# Altium schematic sheet ESP32S3-9INCHES_DISPLAY.SchDoc
size A3; SheetNumber: 1; SheetTotal: 1
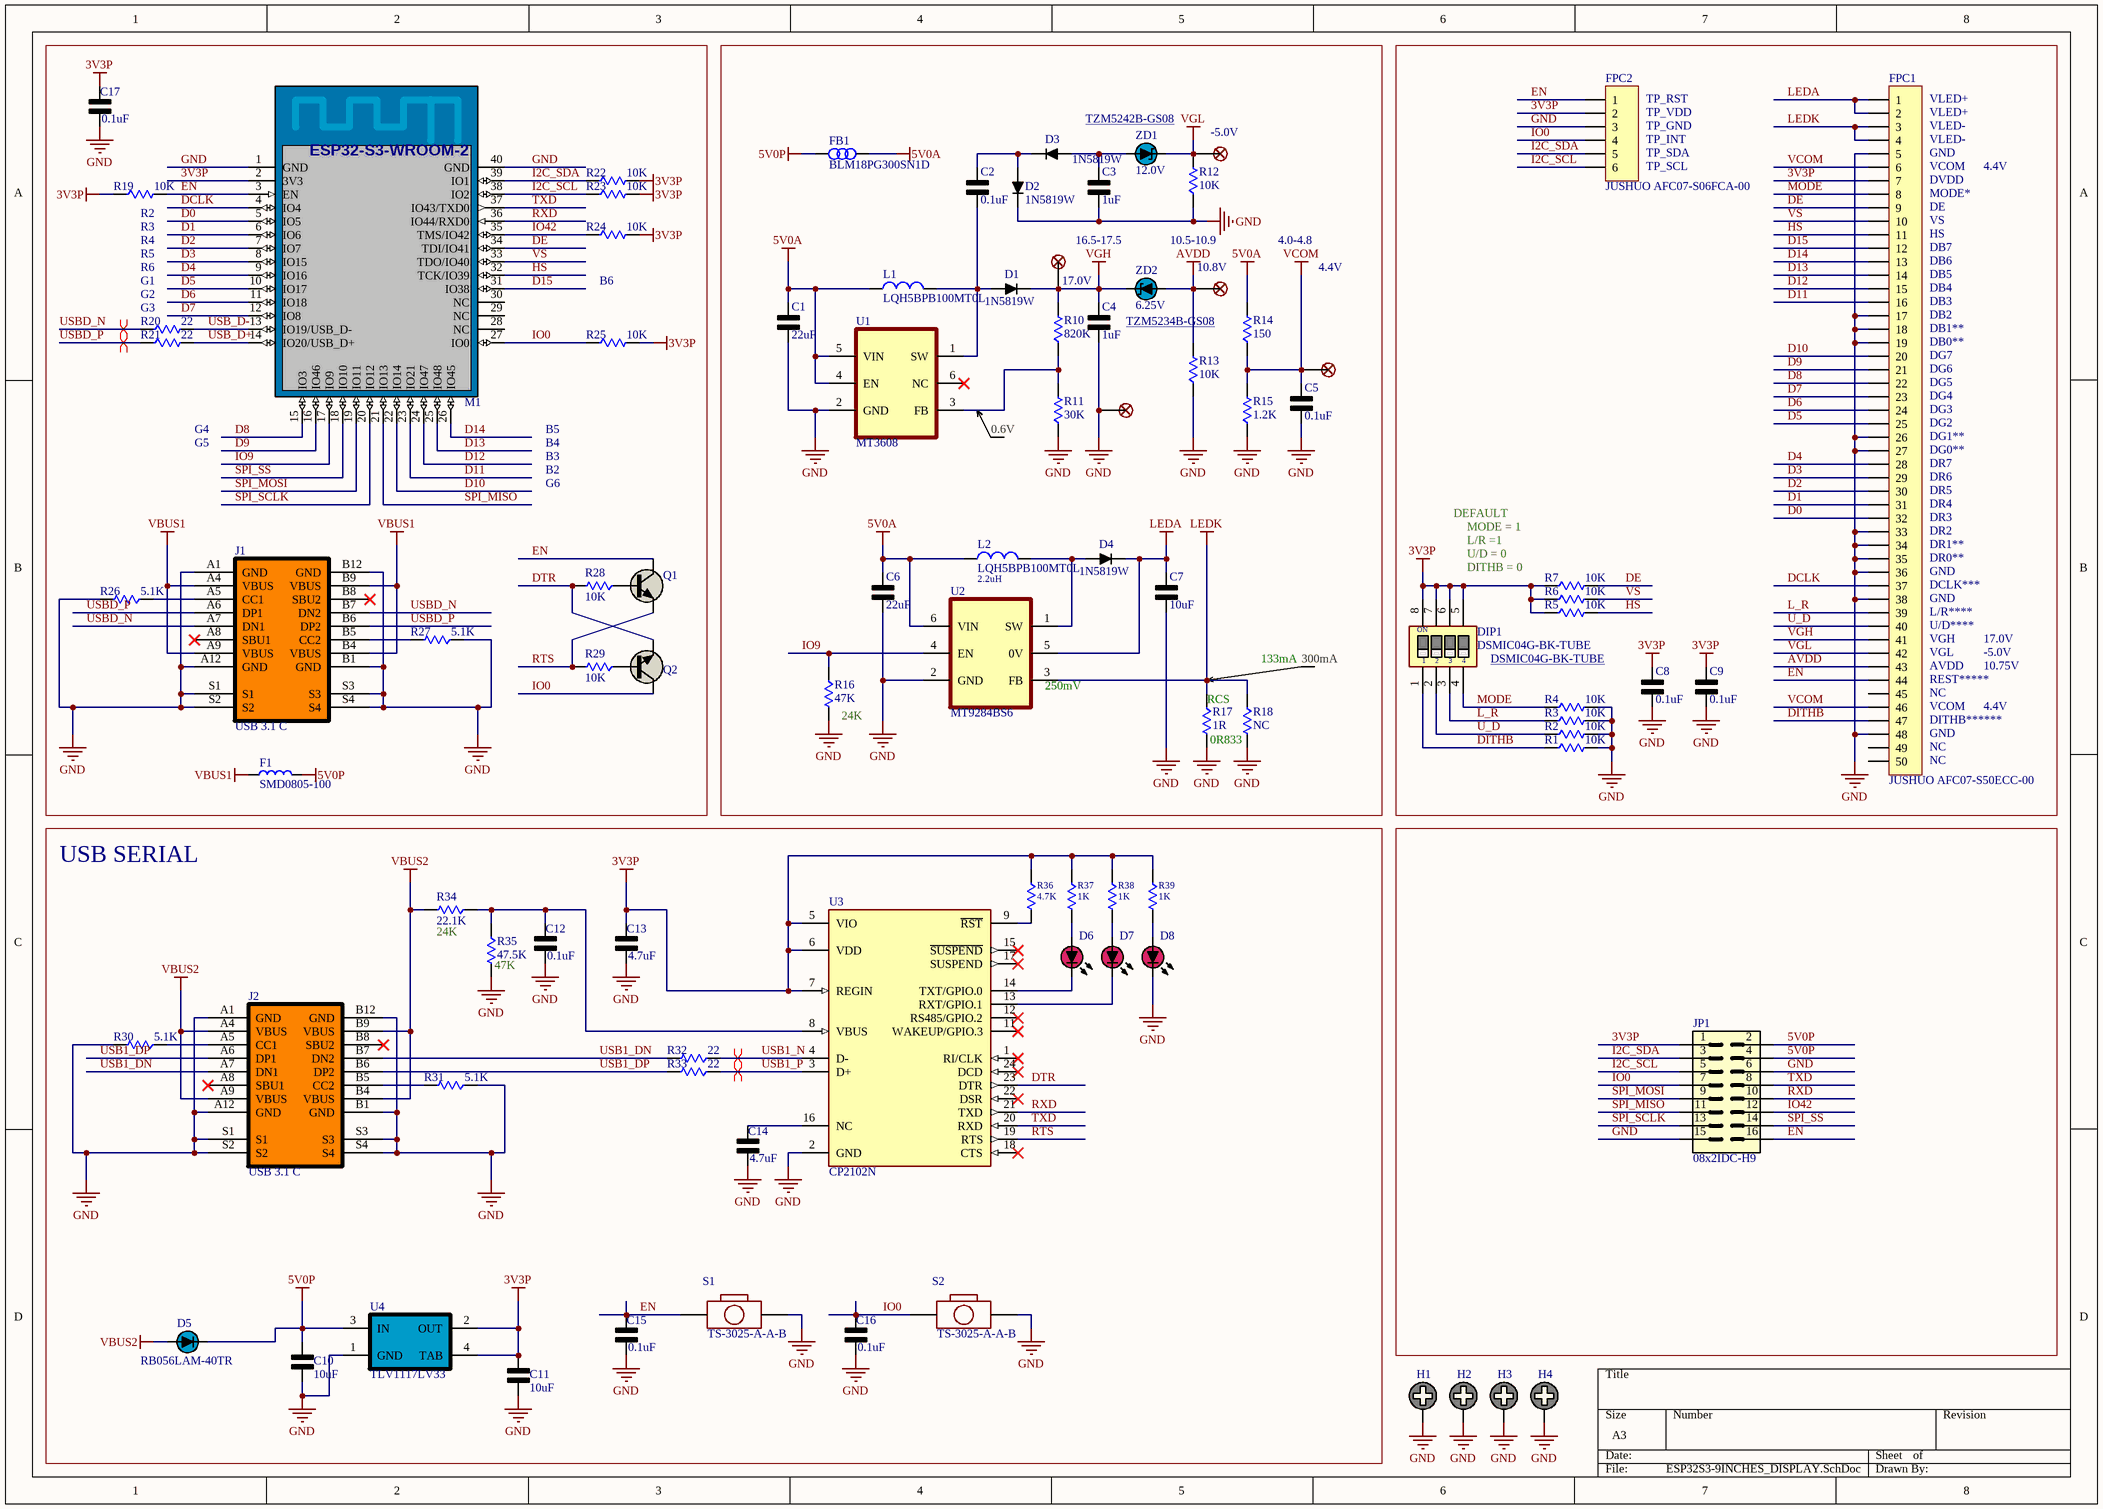
[diagram p0: ESP32S3-9INCHES_DISPLAY.SchDoc]

## Parts
AVDD  Test Point  [MICRO-FIDUCIAL]  (value not drawn)
C1  22uF  [2012[0805]]
C2  0.1uF  [1608[0603]]
C3  1uF  [1608[0603]]
C4  1uF  [1608[0603]]
C5  0.1uF  [1608[0603]]
C6  22uF  [2012[0805]]
C7  10uF  [2012[0805]]
C8  0.1uF  [1608[0603]]
C9  0.1uF  [1608[0603]]
C10  10uF  [2012[0805]]
C11  10uF  [2012[0805]]
C12  0.1uF  [1608[0603]]
C13  4.7uF  [1608[0603]]
C14  4.7uF  [1608[0603]]
C15  0.1uF  [1608[0603]]
C16  0.1uF  [1608[0603]]
C17  0.1uF  [1608[0603]]
D1  1N5819W  [SOD123FL]
D2  1N5819W  [SOD123FL]
D3  1N5819W  [SOD123FL]
D4  1N5819W  [SOD123FL]
D5  RB056LAM-40TR  [SOD128]
D6  LED  [LED_0603_RED]  (value not drawn)
D7  LED  [LED_0603_YELLOW]  (value not drawn)
D8  LED  [LED_0603_YELLOW]  (value not drawn)
DIP1  DSMIC04G-BK-TUBE  [DSMIC04G-BK]
F1  SMD0805-100  [2012[0805]]
FB1  BLM18PG300SN1D  [1608[0603]]
FPC1  JUSHUO AFC07-S50ECC-00  [68715014022]
FPC2  JUSHUO AFC07-S06FCA-00  [68710614522]
GND  Test Point  [MICRO-FIDUCIAL]  (value not drawn)
H1  NUT  [Nut-M3-5 SMT]  (value not drawn)
H2  NUT  [Nut-M3-5 SMT]  (value not drawn)
H3  NUT  [Nut-M3-5 SMT]  (value not drawn)
H4  NUT  [Nut-M3-5 SMT]  (value not drawn)
J1  USB 3.1 C  [USB-C-16P]
J2  USB 3.1 C  [USB-C-16P]
JP1  08x2IDC-H9  [2X08]
L1  LQH5BPB100MT0L  [INDUCTOR_5X5MM_NR5040_NOTHERMALS]
L2  LQH5BPB100MT0L  [INDUCTOR_5X5MM_NR5040_NOTHERMALS]
M1  ESP32-S3-WROOM-2  [ESP32-S3-WROOM-1]  (value not drawn)
Q1  MMBT2222ALT1G  [SOT23N-NPN]  (value not drawn)
Q2  MMBT2222ALT1G  [SOT23N-NPN]  (value not drawn)
R1  10K  [1608[0603]]
R2  10K  [1608[0603]]
R3  10K  [1608[0603]]
R4  10K  [1608[0603]]
R5  10K  [1608[0603]]
R6  10K  [1608[0603]]
R7  10K  [1608[0603]]
R10  820K  [1608[0603]]
R11  30K  [1608[0603]]
R12  10K  [1608[0603]]
R13  10K  [1608[0603]]
R14  150  [1608[0603]]
R15  1.2K  [1608[0603]]
R16  47K  [1608[0603]]
R17  1R  [2012[0805]]
R18  NC  [2012[0805]]
R19  10K  [1608[0603]]
R20  22  [1608[0603]]
R21  22  [1608[0603]]
R22  10K  [1608[0603]]
R23  10K  [1608[0603]]
R24  10K  [1608[0603]]
R25  10K  [1608[0603]]
R26  5.1K  [1608[0603]]
R27  5.1K  [1608[0603]]
R28  10K  [1608[0603]]
R29  10K  [1608[0603]]
R30  5.1K  [1608[0603]]
R31  5.1K  [1608[0603]]
R32  22  [1608[0603]]
R33  22  [1608[0603]]
R34  22.1K  [1608[0603]]
R35  47.5K  [1608[0603]]
R36  4.7K  [1608[0603]]
R37  1K  [1608[0603]]
R38  1K  [1608[0603]]
R39  1K  [1608[0603]]
S1  TS-3025-A-A-B  [SW2-SMD-3.0X2.5X1.2+0.4MM]
S2  TS-3025-A-A-B  [SW2-SMD-3.0X2.5X1.2+0.4MM]
U1  MT3608  [SOT23-6]
U2  MT9284BS6  [SOT23-6]
U3  CP2102N  [QFN24_4X4]
U4  TLV1117LV33  [MP04A_N]
VCOM  Test Point  [MICRO-FIDUCIAL]  (value not drawn)
VGH  Test Point  [MICRO-FIDUCIAL]  (value not drawn)
VGL  Test Point  [MICRO-FIDUCIAL]  (value not drawn)
ZD1  12.0V  [SOD80]
ZD2  6.25V  [SOD80]

## Blocks framed on the sheet
USB SERIAL: C10-C16 D5-D8 J2 R30-R39 S1 S2 U3 U4

## Nets
3V3P: C8.2 C9.2 C11.2 C13.2 C17.2 DIP1.5 DIP1.6 DIP1.7 DIP1.8 FPC1.7 FPC2.2 JP1.1 M1.2(3V3) R5.2 R6.2 R7.2 R19.2 R22.1 R23.1 R24.1 R25.1 R36.2 R37.2 R38.2 R39.2 U3.5(VIO) U3.6(VDD) U3.7(REGIN) U4.2(OUT) U4.4(TAB)
5V0A: C1.2 C6.2 FB1.1 L1.1 L2.1 R14.1 U1.4(EN) U1.5(VIN) U2.6(VIN)
5V0P: C10.2 D5.2(K) F1.1 FB1.2 JP1.2 JP1.4 U4.3(IN)
AVDD: AVDD.1 FPC1.43 R13.1 ZD2.1(A)
GND: C1.1 C3.1 C4.1 C5.1 C6.1 C7.1 C8.1 C9.1 C10.1 C11.1 C12.1 C13.1 C14.1 C15.1 C16.1 C17.1 D2.2(K) D8.2(K) FPC1.5 FPC1.17 FPC1.18 FPC1.19 FPC1.26 FPC1.27 FPC1.33 FPC1.34 FPC1.35 FPC1.36 FPC1.38 FPC1.48 FPC1.Z1 FPC1.Z2 FPC2.3 FPC2.Z1 FPC2.Z2 GND.1 H1.0(GND) H2.0(GND) H3.0(GND) H4.0(GND) J1.A1(GND) J1.A12(GND) J1.B1(GND) J1.B12(GND) J1.S1 J1.S2 J1.S3 J1.S4 J2.A1(GND) J2.A12(GND) J2.B1(GND) J2.B12(GND) J2.S1 J2.S2 J2.S3 J2.S4 JP1.6 JP1.15 M1.1(GND) M1.40(GND) M1.41(EPAD) R1.1 R2.1 R3.1 R4.1 R11.2 R12.2 R13.2 R15.2 R16.1 R17.1 R18.1 R26.1 R27.2 R30.1 R31.2 R35.1 S1.2 S2.2 U1.2(GND) U2.2(GND) U3.2(GND) U3.25(HEAT_TAB) U4.1(GND)
LEDA: C7.2 D4.2(K) FPC1.1 FPC1.2 U2.5(0V)
LEDK: FPC1.3 FPC1.4 R17.2 R18.2 U2.3(FB)
VBUS1: F1.2 J1.A4(VBUS) J1.A9(VBUS) J1.B4(VBUS) J1.B9(VBUS)
VBUS2: D5.1(A) J2.A4(VBUS) J2.A9(VBUS) J2.B4(VBUS) J2.B9(VBUS) R34.1
VCOM: C5.2 FPC1.6 FPC1.46 R14.2 R15.1 VCOM.1
VGH: C4.2 D1.2(K) FPC1.41 R10.1 VGH.1 ZD2.2(K)
VGL: FPC1.42 R12.1 VGL.1 ZD1.2(K)
D0: FPC1.32 M1.5(IO5)
D1: FPC1.31 M1.6(IO6)
D2: FPC1.30 M1.7(IO7)
D3: FPC1.29 M1.8(IO15)
D4: FPC1.28 M1.9(IO16)
D5: FPC1.25 M1.10(IO17)
D6: FPC1.24 M1.11(IO18)
D7: FPC1.23 M1.12(IO8)
D8: FPC1.22 M1.15(IO3)
D9: FPC1.21 M1.16(IO46)
D10: FPC1.20 M1.22(IO14)
D11: FPC1.16 M1.23(IO21)
D12: FPC1.15 M1.24(IO47)
D13: FPC1.14 M1.25(IO48)
D14: FPC1.13 M1.26(IO45)
D15: FPC1.12 M1.31(IO38)
DCLK: FPC1.37 M1.4(IO4)
DE: FPC1.9 M1.34(TDI/IO41) R7.1
DITHB: DIP1.1 FPC1.47 R1.2
DTR: Q2.2(E) R28.1 U3.23(DTR)
EN: C15.2 FPC1.44 FPC2.1 JP1.16 M1.3(EN) Q1.3(C) R19.1 S1.1
HS: FPC1.11 M1.32(TCK/IO39) R5.1
I2C_SCL: FPC2.6 JP1.5 M1.38(IO2) R23.2
I2C_SDA: FPC2.5 JP1.3 M1.39(IO1) R22.2
IO0: C16.2 FPC2.4 JP1.7 M1.27(IO0) Q2.3(C) R25.2 S2.1
IO9: M1.17(IO9) R16.2 U2.4(EN)
IO42: JP1.12 M1.35(TMS/IO42) R24.2
L_R: DIP1.3 FPC1.39 R3.2
MODE: DIP1.4 FPC1.8 R4.2
RTS: Q1.2(E) R29.1 U3.19(RTS)
RXD: JP1.10 M1.36(IO44/RXD0) U3.21(TXD)
SPI_MISO: JP1.11 M1.21(IO13)
SPI_MOSI: JP1.9 M1.19(IO11)
SPI_SCLK: JP1.13 M1.20(IO12)
SPI_SS: JP1.14 M1.18(IO10)
TXD: JP1.8 M1.37(IO43/TXD0) U3.20(RXD)
U_D: DIP1.2 FPC1.40 R2.2
USB1_DN: J2.A7(DN1) J2.B7(DN2) R32.1
USB1_DP: J2.A6(DP1) J2.B6(DP2) R33.1
USB1_N: R32.2 U3.4(D-)
USB1_P: R33.2 U3.3(D+)
USB_D+: M1.14(IO20/USB_D+) R21.1
USB_D-: M1.13(IO19/USB_D-) R20.1
USBD_N: J1.A7(DN1) J1.B7(DN2) R20.2
USBD_P: J1.A6(DP1) J1.B6(DP2) R21.2
VS: FPC1.10 M1.33(TDO/IO40) R6.1
NetC2_1: C2.1 D1.1(A) L1.2 U1.1(SW)
NetC2_2: C2.2 D2.1(A) D3.2(K)
NetC3_2: C3.2 D3.1(A) ZD1.1(A)
NetC12_2: C12.2 R34.2 R35.2 U3.8(VBUS)
NetC14_2: C14.2 U3.16(NC)
NetD4_1: D4.1(A) L2.2 U2.1(SW)
NetD6_1: D6.1(A) R37.1
NetD6_2: D6.2(K) U3.14(TXT/GPIO.0)
NetD7_1: D7.1(A) R38.1
NetD7_2: D7.2(K) U3.13(RXT/GPIO.1)
NetD8_1: D8.1(A) R39.1
NetJ1_A5: J1.A5(CC1) R26.2
NetJ1_B5: J1.B5(CC2) R27.1
NetJ2_A5: J2.A5(CC1) R30.2
NetJ2_B5: J2.B5(CC2) R31.1
NetQ1_1: Q1.1(B) R28.2
NetQ2_1: Q2.1(B) R29.2
NetR10_2: R10.2 R11.1 U1.3(FB)
NetR36_1: R36.1 U3.9(~{RST})

Not connected (* = marked no-connect by the designer): FPC1 45 49 50; J1 A8(SBU1)* B8(SBU2)*; J2 A8(SBU1)* B8(SBU2)*; M1 28(NC) 29(NC) 30(NC); U1 6(NC)*; U3 1(RI/CLK)* 10(NC) 11(WAKEUP/GPIO.3)* 12(RS485/GPIO.2)* 15(~{SUSPEND})* 17(SUSPEND)* 18(CTS)* 22(DSR)* 24(DCD)*

## Layout directives
differential pair: USB1_N, USB1_P, USBD_N, USBD_P

## Notes on the sheet
- (near FPC2) TP_RST
- (near FPC1) VLED+
- TZM5242B-GS08 <https://www.es.co.th/detail.asp?Prod=013503850>
- (near VGL) -5.0V
- (near FPC2) TP_VDD
- (near FPC2) TP_GND
- (near FPC2) TP_INT
- (near FPC2) TP_SDA
- (near FPC2) TP_SCL
- (near FPC1) VLED-
- (near FPC1) GND
- (near FPC1) VCOM
- (near FPC1) DVDD
- 4.4V
- (near R19) R2
- (near R19) R3
- (near R19) R4
- (near VGH) 16.5-17.5
- 10.5-10.9
- 4.0-4.8
- (near FPC1) MODE*
- (near FPC1) DE
- (near FPC1) VS
- (near FPC1) HS
- R5
- R6
- G1
- G2
- (near R20) G3
- B6
- (near VGH) 17.0V
- (near AVDD) 10.8V
- (near FPC1) DB7
- (near FPC1) DB6
- (near FPC1) DB5
- (near FPC1) DB4
- (near FPC1) DB3
- (near FPC1) DB2
- TZM5234B-GS08 <https://www.es.co.th/detail.asp?Prod=013503818>
- (near FPC1) DB1**
- (near FPC1) DB0**
- (near FPC1) DG7
- (near FPC1) DG6
- G4
- G5
- B4
- B5
- 0.6V
- (near FPC1) DG5
- (near FPC1) DG4
- (near FPC1) DG3
- (near FPC1) DG2
- (near FPC1) DG1**
- (near FPC1) DG0**
- G6
- B2
- B3
- DEFAULT
- (near FPC1) DR7
- (near FPC1) DR6
- (near FPC1) DR5
- (near FPC1) DR4
- (near L2) 2.2uH
- MODE = 1
- L/R =1
- U/D = 0
- DITHB = 0
- (near FPC1) DR3
- (near FPC1) DR2
- (near FPC1) DR1**
- (near FPC1) DR0**
- (near FPC1) DCLK***
- (near FPC1) L/R****
- (near FPC1) U/D****
- (near FPC1) VGH
- 17.0V
- (near R16) 24K
- (near U2) 250mV
- (near R17) RCS
- 133mA
- 300mA
- DSMIC04G-BK-TUBE <https://www.es.co.th/detail.asp?Prod=000714364>
- (near FPC1) VGL
- (near FPC1) AVDD
- (near FPC1) REST*****
- (near FPC1) NC
- (near FPC1) DITHB******
- -5.0V
- 10.75V
- 0R833
- (near R34) 24K
- (near R35) 47K
- (in symbol DIP SWITCH 4 POS) ON

## Library data of the parts
AVDD GND VCOM VGH VGL = Test Point: Fiducial Alignment PointsVarious fiducial points for machine vision alignment.
C1-C17 = Cap: Capacitor
D1-D4 = 1N5819W: 40V 1A 600mV @ 1A SOD-123F Schottky Barrier Diodes (SBD) RoHS
D5 = Diode: Default Diode
D6-D8 = LED: Typical INFRARED GaAs LED; Published: 8-Jun-2000; LatestRevisionDate: 08-Jul-2005; LatestRevisionNote: Mech Layer 1 removed.; PackageReference: LED-0; Publisher: Altium Limited
DIP1 = DIP SWITCH 4 POS: Dip Switch SPST SMT Type,4 Position,Pitch 2.54mm.; ES P/N: 0007-1436-4; Product P/N: DSMIC04G-BK-TUBE; LINK: https://www.es.co.th/detail.asp?Prod=000714364
F1 = MPZ2012S101AT: Ferrite Beads & Chip for EMI; Published: 24-Mar-1999; LatestRevisionDate: 29-May-2009; LatestRevisionNote: IPC-7351 Footprint Added.; PackageVersion: Mar-2003; PackageReference: 6-0805; Publisher: Altium Limited; PackageDescription: Chip Resistor 0805 Case Size; Code_IPC: RESC2012
FB1 = MMZ1608B301C: Published: 24-Mar-1999; LatestRevisionDate: 29-May-2009; LatestRevisionNote: IPC-7351 Footprint Added.; PackageVersion: Mar-2003; PackageReference: 6-0805; Publisher: Altium Limited; PackageDescription: Chip Resistor 0805 Case Size; Code_IPC: RESC2012
FPC1 = WE-ZIF Connector WR-FPC 68715014022: WR-FPC 0.50mm SMT ZIF Horizontal Top Contact; Manufacturer: Wจนrth Elektronik eiSos GmbH; ComponentLink1 Description: Manufacturer; ComponentLink2 Description: Datasheet; NoPins: 50; Created Date: 21 October 2013; partNo: 68715014022; ComponentLink1URL: http://www.we-online.com; ComponentLink2URL: http://katalog.we-online.de/em/datasheet/6871xx14022.pdf; Created by: Karrer Zheng
FPC2 = WE-ZIF Connector WR-FPC 68710614522: WR-FPC 0.50mm SMT ZIF Horizontal Bottom Contact; Manufacturer: W¨¹rth Elektronik eiSos GmbH; ComponentLink1 Description: Manufacturer; ComponentLink2 Description: Datasheet; NoPins: 06; Created Date: 28 October 2013; partNo: 68710614522; ComponentLink1URL: http://www.we-online.com; ComponentLink2URL: http://katalog.we-online.de/em/datasheet/6871xx14522.pdf; Created by: Karrer Zheng
H1-H4 = Nut: Hold
J1 J2 = USB-3.1-Type-C: USB 3.1 Type C
JP1 = PINHD-2X08IDC: IDC Header 16 Pins Male
L1 L2 = Inductor: Code_IEC: 1005; Value: 10mH; Published: 8-Jun-2000; LatestRevisionDate: 29-May-2009; LatestRevisionNote: IPC-7351 Footprint Added.; PackageReference: 0402-A; Publisher: Altium Limited; PackageDescription: Chip Inductor; Code_JEITA: 0402
Q1 Q2 = MMBT2222ALT1G: Transistor NPN 40V/0.6A,General purpose; Published: 8-Jun-2000; LatestRevisionDate: 17-Jul-2002; LatestRevisionNote: Re-released for DXP Platform.; PackageReference: TO-226-AA; Publisher: Altium Limited; PackageDescription: TO, Flat Index; 3 In-Line, Axial Leads; Body Dia. 4.8mm; Leads 0.55 x 0.51 mm (max); Code_JEDEC: TO-226-AA
R1-R7 R10-R39 = Res: Resistor
  R1-R7 R10-R35: Published: 24-Mar-1999; LatestRevisionDate: 29-May-2009; LatestRevisionNote: IPC-7351 Footprint Added.; PackageVersion: Mar-2003; PackageReference: 6-0805; Publisher: Altium Limited; PackageDescription: Chip Resistor 0805 Case Size; Code_IPC: RESC2012
  R36: Value: 4.7K
  R37-R39: Value: 1K
S1 S2 = Tact SW: SMD-BUTTON-WITHOUT-BOSS-(2P-3X2.5MM); VALUE: B3U-1000P
U1 = MT3608: Step-Up Positive Adjustable 1 1.2MHz SOT-23-6 DC-DC Converters RoHS
U2 = MT9284: SOT-23-6 LED Drivers RoHS
U3 = CP2102N: SINGLE-CHIP USB-TO-UART BRIDGE; RefDes: RefDes; Type: Type; Value: Value
U4 = LD1117AS33TR: 1000mA Low-Dropout Linear Regulator, 4-pin SOT-223; PartNumber: LM1117IMP-3.3; Manufacturer: National Semiconductor; PackageTopMarking: XYTT*N05B; PowerWise: N; CompType: LDO IC; Published: 4-Dec-2008; DatasheetVersion: Apr-2006; PackageVersion: revB, Apr-2003; PackageReference: MP04A; Publisher: Altium Limited; PackageDescription: Molded SOT-223, 6.50 x 3.56 x 1.6mm Body, 4 Lead, 2.3mm Pitch; Supplier 1: Farnell; Supplier Part Number 1: 7614123; RoHS: N; PinCount: 4; Code_JEDEC: TO-261-AA; Code_IPC: SOT223-4; ComponentLink1Description: LM1117 Datasheet; ComponentLink1URL: http://www.national.com/ds/LM/LM1117.pdf; ComponentLink2Description: LM1117 Web Page; ComponentLink2URL: http://www.national.com/pf/LM/LM1117.html; ComponentLink3Description: MP04A Package Page; ComponentLink3URL: http://www.national.com/packaging/folders/mp04a.html
ZD1 ZD2 = Zener: Zener Diode